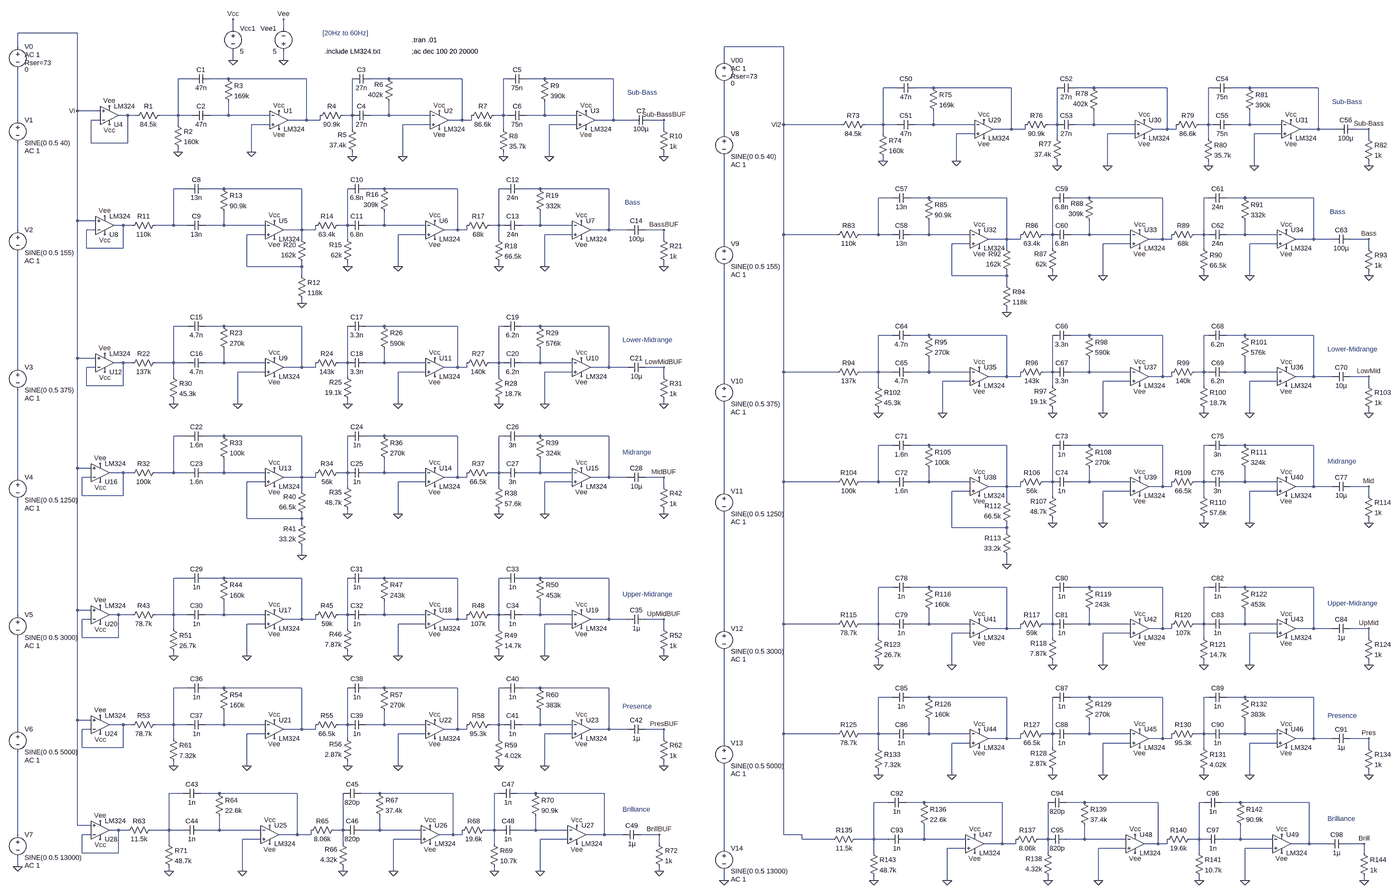
[diagram p0: schematic AllFiltersBuf_NonBuf.asc, whole sheet]
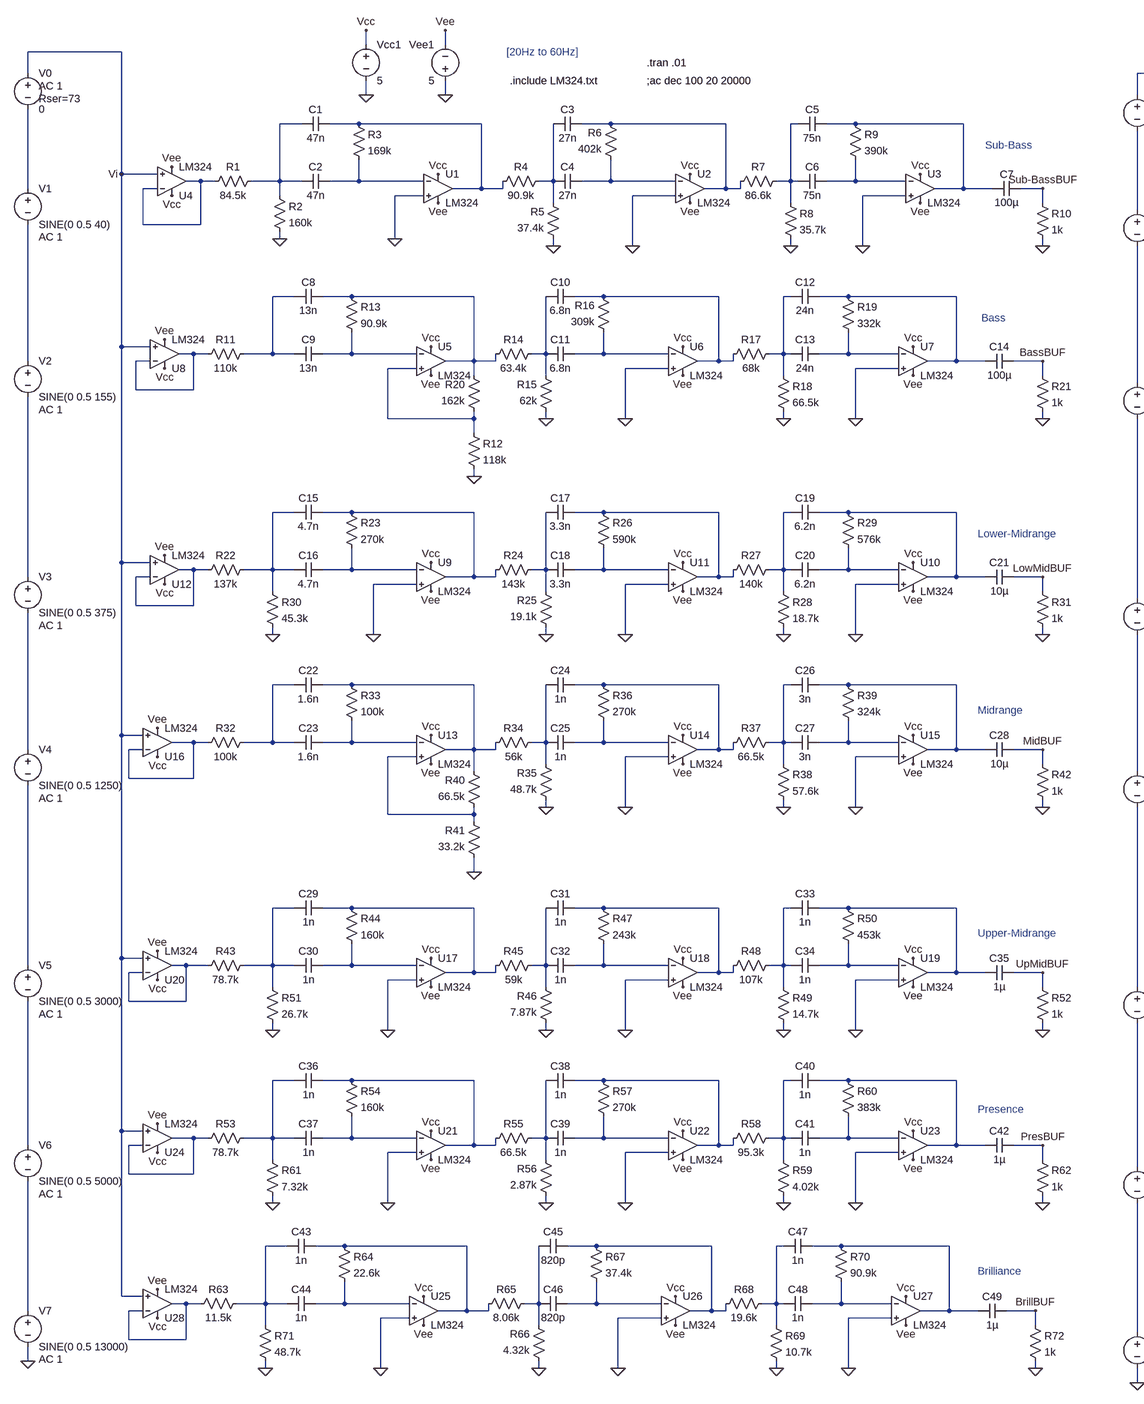
[diagram p1: schematic AllFiltersBuf_NonBuf.asc, part, row 1 of 1, column 1 of 2]
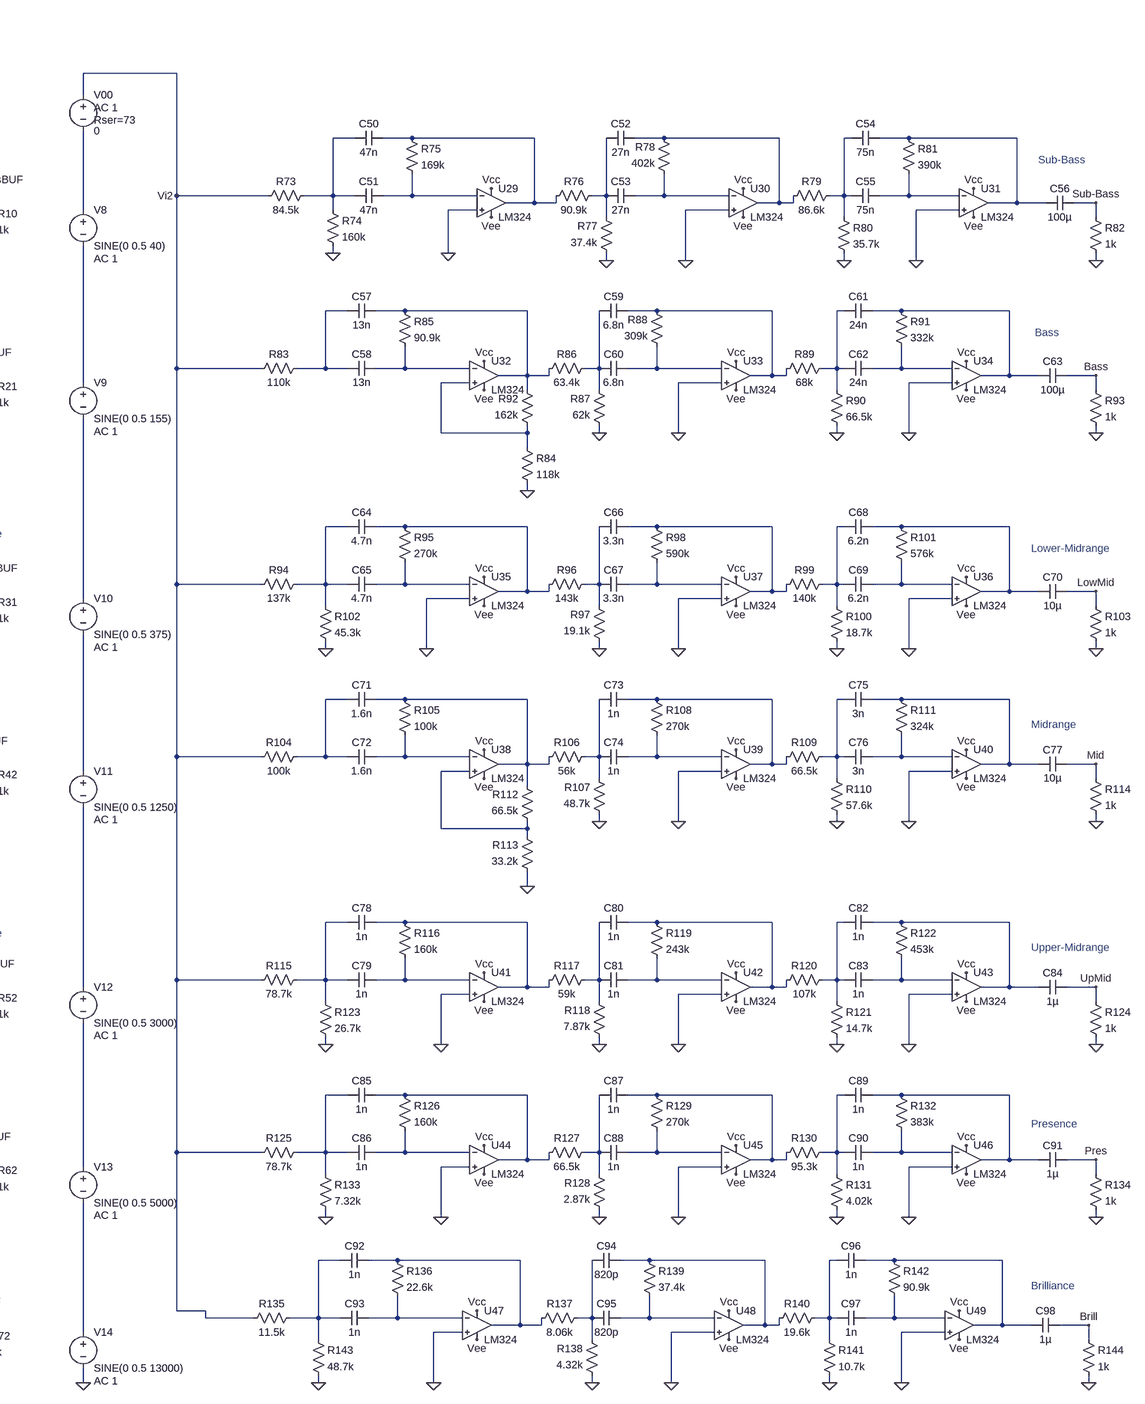
[diagram p2: schematic AllFiltersBuf_NonBuf.asc, part, row 1 of 1, column 2 of 2]
* AllFiltersBuf_NonBuf.asc
R1 N001 N011 84.5k
V1 N016 N037 SINE(0 0.5 40) AC 1
R2 N001 0 160k
R3 N002 N012 169k
R4 N013 N002 90.9k
R5 0 N013 37.4k
R6 N014 N003 402k
R7 N003 N004 86.6k
R8 N004 0 35.7k
R9 N005 N015 390k
C1 N002 N001 47n
C2 N012 N001 47n
C3 N003 N013 27n
C4 N014 N013 27n
C5 N005 N004 75n
C6 N015 N004 75n
XU1 0 N012 Vcc Vee N002 LM324  ; pins In+ In- V+ V- OUT
XU2 0 N014 Vcc Vee N003 LM324  ; pins In+ In- V+ V- OUT
XU3 0 N015 Vcc Vee N005 LM324  ; pins In+ In- V+ V- OUT
Vcc1 Vcc 0 5
Vee1 0 Vee 5
C7 Sub-BassBUF N005 100µ
R10 Sub-BassBUF 0 1k
XU4 Vi N011 Vcc Vee N011 LM324  ; pins In+ In- V+ V- OUT
R11 N022 N032 110k
V2 N037 N060 SINE(0 0.5 155) AC 1
R12 N038 0 118k
R13 N023 N033 90.9k
R14 N034 N023 63.4k
R15 0 N034 62k
R16 N035 N024 309k
R17 N024 N025 68k
R18 N025 0 66.5k
R19 N026 N036 332k
C8 N023 N022 13n
C9 N033 N022 13n
C10 N024 N034 6.8n
C11 N035 N034 6.8n
C12 N026 N025 24n
C13 N036 N025 24n
R20 N038 N023 162k
XU5 N038 N033 Vcc Vee N023 LM324  ; pins In+ In- V+ V- OUT
XU6 0 N035 Vcc Vee N024 LM324  ; pins In+ In- V+ V- OUT
XU7 0 N036 Vcc Vee N026 LM324  ; pins In+ In- V+ V- OUT
C14 BassBUF N026 100µ
R21 BassBUF 0 1k
XU8 Vi N032 Vcc Vee N032 LM324  ; pins In+ In- V+ V- OUT
R22 N045 N055 137k
V3 N060 N081 SINE(0 0.5 375) AC 1
R23 N046 N056 270k
R24 N057 N046 143k
R25 0 N057 19.1k
R26 N047 N058 590k
R27 N047 N048 140k
R28 N048 0 18.7k
R29 N049 N059 576k
C15 N046 N045 4.7n
C16 N056 N045 4.7n
C17 N047 N057 3.3n
C18 N058 N057 3.3n
C19 N049 N048 6.2n
C20 N059 N048 6.2n
R30 N045 0 45.3k
XU9 0 N056 Vcc Vee N046 LM324  ; pins In+ In- V+ V- OUT
XU10 0 N059 Vcc Vee N049 LM324  ; pins In+ In- V+ V- OUT
XU11 0 N058 Vcc Vee N047 LM324  ; pins In+ In- V+ V- OUT
C21 LowMidBUF N049 10µ
R31 LowMidBUF 0 1k
XU12 Vi N055 Vcc Vee N055 LM324  ; pins In+ In- V+ V- OUT
R32 N066 N076 100k
V4 N081 N099 SINE(0 0.5 1250) AC 1
R33 N067 N077 100k
R34 N078 N067 56k
R35 0 N078 48.7k
R36 N068 N079 270k
R37 N068 N069 66.5k
R38 N069 0 57.6k
R39 N070 N080 324k
C22 N067 N066 1.6n
C23 N077 N066 1.6n
C24 N068 N078 1n
C25 N079 N078 1n
C26 N070 N069 3n
C27 N080 N069 3n
R40 N082 N067 66.5k
R41 0 N082 33.2k
XU13 N082 N077 Vcc Vee N067 LM324  ; pins In+ In- V+ V- OUT
XU14 0 N079 Vcc Vee N068 LM324  ; pins In+ In- V+ V- OUT
XU15 0 N080 Vcc Vee N070 LM324  ; pins In+ In- V+ V- OUT
C28 MidBUF N070 10µ
R42 MidBUF 0 1k
XU16 Vi N076 Vcc Vee N076 LM324  ; pins In+ In- V+ V- OUT
R43 N089 N100 78.7k
V5 N099 N125 SINE(0 0.5 3000) AC 1
R44 N090 N101 160k
R45 N102 N090 59k
R46 0 N102 7.87k
R47 N091 N103 243k
R48 N091 N092 107k
R49 N092 0 14.7k
R50 N093 N104 453k
C29 N090 N089 1n
C30 N101 N089 1n
C31 N091 N102 1n
C32 N103 N102 1n
C33 N093 N092 1n
C34 N104 N092 1n
R51 N089 0 26.7k
XU17 0 N101 Vcc Vee N090 LM324  ; pins In+ In- V+ V- OUT
XU18 0 N103 Vcc Vee N091 LM324  ; pins In+ In- V+ V- OUT
XU19 0 N104 Vcc Vee N093 LM324  ; pins In+ In- V+ V- OUT
C35 UpMidBUF N093 1µ
R52 UpMidBUF 0 1k
XU20 Vi N100 Vcc Vee N100 LM324  ; pins In+ In- V+ V- OUT
R53 N110 N120 78.7k
V6 N125 N146 SINE(0 0.5 5000) AC 1
R54 N111 N121 160k
R55 N122 N111 66.5k
R56 0 N122 2.87k
R57 N112 N123 270k
R58 N112 N113 95.3k
R59 N113 0 4.02k
R60 N114 N124 383k
C36 N111 N110 1n
C37 N121 N110 1n
C38 N112 N122 1n
C39 N123 N122 1n
C40 N114 N113 1n
C41 N124 N113 1n
R61 N110 0 7.32k
XU21 0 N121 Vcc Vee N111 LM324  ; pins In+ In- V+ V- OUT
XU22 0 N123 Vcc Vee N112 LM324  ; pins In+ In- V+ V- OUT
XU23 0 N124 Vcc Vee N114 LM324  ; pins In+ In- V+ V- OUT
C42 PresBUF N114 1µ
R62 PresBUF 0 1k
XU24 Vi N120 Vcc Vee N120 LM324  ; pins In+ In- V+ V- OUT
R63 N131 N141 11.5k
V7 N146 0 SINE(0 0.5 13000) AC 1
R64 N132 N142 22.6k
R65 N143 N132 8.06k
R66 0 N143 4.32k
R67 N133 N144 37.4k
R68 N133 N134 19.6k
R69 N134 0 10.7k
R70 N135 N145 90.9k
C43 N132 N131 1n
C44 N142 N131 1n
C45 N133 N143 820p
C46 N144 N143 820p
C47 N135 N134 1n
C48 N145 N134 1n
R71 N131 0 48.7k
XU25 0 N142 Vcc Vee N132 LM324  ; pins In+ In- V+ V- OUT
XU26 0 N144 Vcc Vee N133 LM324  ; pins In+ In- V+ V- OUT
XU27 0 N145 Vcc Vee N135 LM324  ; pins In+ In- V+ V- OUT
C49 BrillBUF N135 1µ
R72 BrillBUF 0 1k
XU28 Vi N141 Vcc Vee N141 LM324  ; pins In+ In- V+ V- OUT
V0 Vi N016 0 AC 1 Rser=73
R73 N006 Vi2 84.5k
R74 N006 0 160k
R75 N007 N017 169k
R76 N018 N007 90.9k
R77 0 N018 37.4k
R78 N019 N008 402k
R79 N008 N009 86.6k
R80 N009 0 35.7k
R81 N010 N020 390k
C50 N007 N006 47n
C51 N017 N006 47n
C52 N008 N018 27n
C53 N019 N018 27n
C54 N010 N009 75n
C55 N020 N009 75n
XU29 0 N017 Vcc Vee N007 LM324  ; pins In+ In- V+ V- OUT
XU30 0 N019 Vcc Vee N008 LM324  ; pins In+ In- V+ V- OUT
XU31 0 N020 Vcc Vee N010 LM324  ; pins In+ In- V+ V- OUT
C56 Sub-Bass N010 100µ
R82 Sub-Bass 0 1k
R83 N027 Vi2 110k
R84 N044 0 118k
R85 N028 N039 90.9k
R86 N040 N028 63.4k
R87 0 N040 62k
R88 N041 N029 309k
R89 N029 N030 68k
R90 N030 0 66.5k
R91 N031 N042 332k
C57 N028 N027 13n
C58 N039 N027 13n
C59 N029 N040 6.8n
C60 N041 N040 6.8n
C61 N031 N030 24n
C62 N042 N030 24n
R92 N044 N028 162k
XU32 N044 N039 Vcc Vee N028 LM324  ; pins In+ In- V+ V- OUT
XU33 0 N041 Vcc Vee N029 LM324  ; pins In+ In- V+ V- OUT
XU34 0 N042 Vcc Vee N031 LM324  ; pins In+ In- V+ V- OUT
C63 Bass N031 100µ
R93 Bass 0 1k
R94 N050 Vi2 137k
R95 N051 N061 270k
R96 N062 N051 143k
R97 0 N062 19.1k
R98 N052 N063 590k
R99 N052 N053 140k
R100 N053 0 18.7k
R101 N054 N064 576k
C64 N051 N050 4.7n
C65 N061 N050 4.7n
C66 N052 N062 3.3n
C67 N063 N062 3.3n
C68 N054 N053 6.2n
C69 N064 N053 6.2n
R102 N050 0 45.3k
XU35 0 N061 Vcc Vee N051 LM324  ; pins In+ In- V+ V- OUT
XU36 0 N064 Vcc Vee N054 LM324  ; pins In+ In- V+ V- OUT
XU37 0 N063 Vcc Vee N052 LM324  ; pins In+ In- V+ V- OUT
C70 LowMid N054 10µ
R103 LowMid 0 1k
R104 N071 Vi2 100k
R105 N072 N083 100k
R106 N084 N072 56k
R107 0 N084 48.7k
R108 N073 N085 270k
R109 N073 N074 66.5k
R110 N074 0 57.6k
R111 N075 N086 324k
C71 N072 N071 1.6n
C72 N083 N071 1.6n
C73 N073 N084 1n
C74 N085 N084 1n
C75 N075 N074 3n
C76 N086 N074 3n
R112 N088 N072 66.5k
R113 0 N088 33.2k
XU38 N088 N083 Vcc Vee N072 LM324  ; pins In+ In- V+ V- OUT
XU39 0 N085 Vcc Vee N073 LM324  ; pins In+ In- V+ V- OUT
XU40 0 N086 Vcc Vee N075 LM324  ; pins In+ In- V+ V- OUT
C77 Mid N075 10µ
R114 Mid 0 1k
R115 N094 Vi2 78.7k
R116 N095 N105 160k
R117 N106 N095 59k
R118 0 N106 7.87k
R119 N096 N107 243k
R120 N096 N097 107k
R121 N097 0 14.7k
R122 N098 N108 453k
C78 N095 N094 1n
C79 N105 N094 1n
C80 N096 N106 1n
C81 N107 N106 1n
C82 N098 N097 1n
C83 N108 N097 1n
R123 N094 0 26.7k
XU41 0 N105 Vcc Vee N095 LM324  ; pins In+ In- V+ V- OUT
XU42 0 N107 Vcc Vee N096 LM324  ; pins In+ In- V+ V- OUT
XU43 0 N108 Vcc Vee N098 LM324  ; pins In+ In- V+ V- OUT
C84 UpMid N098 1µ
R124 UpMid 0 1k
R125 N115 Vi2 78.7k
R126 N116 N126 160k
R127 N127 N116 66.5k
R128 0 N127 2.87k
R129 N117 N128 270k
R130 N117 N118 95.3k
R131 N118 0 4.02k
R132 N119 N129 383k
C85 N116 N115 1n
C86 N126 N115 1n
C87 N117 N127 1n
C88 N128 N127 1n
C89 N119 N118 1n
C90 N129 N118 1n
R133 N115 0 7.32k
XU44 0 N126 Vcc Vee N116 LM324  ; pins In+ In- V+ V- OUT
XU45 0 N128 Vcc Vee N117 LM324  ; pins In+ In- V+ V- OUT
XU46 0 N129 Vcc Vee N119 LM324  ; pins In+ In- V+ V- OUT
C91 Pres N119 1µ
R134 Pres 0 1k
R135 N136 Vi2 11.5k
R136 N137 N147 22.6k
R137 N148 N137 8.06k
R138 0 N148 4.32k
R139 N138 N149 37.4k
R140 N138 N139 19.6k
R141 N139 0 10.7k
R142 N140 N150 90.9k
C92 N137 N136 1n
C93 N147 N136 1n
C94 N138 N148 820p
C95 N149 N148 820p
C96 N140 N139 1n
C97 N150 N139 1n
R143 N136 0 48.7k
XU47 0 N147 Vcc Vee N137 LM324  ; pins In+ In- V+ V- OUT
XU48 0 N149 Vcc Vee N138 LM324  ; pins In+ In- V+ V- OUT
XU49 0 N150 Vcc Vee N140 LM324  ; pins In+ In- V+ V- OUT
C98 Brill N140 1µ
R144 Brill 0 1k
V8 N021 N043 SINE(0 0.5 40) AC 1
V9 N043 N065 SINE(0 0.5 155) AC 1
V10 N065 N087 SINE(0 0.5 375) AC 1
V11 N087 N109 SINE(0 0.5 1250) AC 1
V12 N109 N130 SINE(0 0.5 3000) AC 1
V13 N130 N151 SINE(0 0.5 5000) AC 1
V14 N151 0 SINE(0 0.5 13000) AC 1
V00 Vi2 N021 0 AC 1 Rser=73
.tran .01
;ac dec 100 20 20000
* [20Hz to 60Hz]
.include LM324.txt
* Sub-Bass
* Bass
* Lower-Midrange
* Midrange
* Upper-Midrange
* Presence
* Brilliance
* Sub-Bass
* Bass
* Lower-Midrange
* Midrange
* Upper-Midrange
* Presence
* Brilliance
.backanno
.end